# EasyEDA Pro project Glowbe-60panels.eprj

# Board PCB1
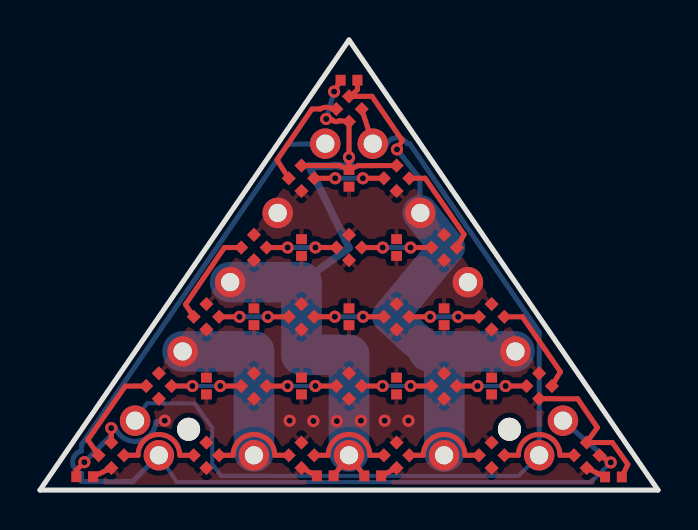
[diagram p0: board, top side]
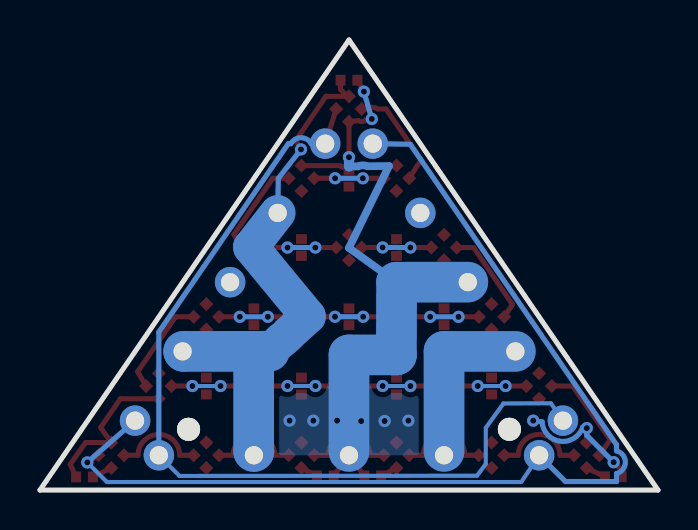
[diagram p1: board, bottom side, seen from below]

Outline 30.9 x 22.54 mm; copper layers: Top Layer, Bottom Layer. Coordinates in mm from the lower left corner of the outline.
Outline path: 0,0 30.9,0 15.45,22.54 0,0
Stack: Top Layer 0.035mm / Dielectric1 1.51mm FR4 er 4.5 / Bottom Layer 0.035mm

## Design rules (mm)
template: Custom Config
spacing copperThickness1oz (default): track to track 0.102, other pairs 0.152 to 0.3
spacing copperThickness2oz: track to track 0.203, other pairs 0.152 to 0.3
track width copperThickness1oz (default): min 0.127, default 0.254, max 2.54
track width copperThickness2oz: min 0.203, default 0.254, max 2.54
differential pair differentialPair (default): width min 0.127, default 0.254, max 2.54; gap min 0.152, default 0.152
via viaSize (default): diameter min 0.5, default 0.61, max 10; hole min 0.3, default 0.305, max 6.3

## Placement (name value [footprint] x y rotation side)
C1  100nF  [C0402]  8.32 5.21 270 top
C2  100nF  [C0402]  13.07 5.21 270 top
C3  100nF  [C0402]  17.83 5.21 270 top
C4  100nF  [C0402]  22.58 5.21 270 top
C8  100nF  [C0402]  10.7 8.68 270 top
C9  100nF  [C0402]  15.45 8.68 270 top
C10  100nF  [C0402]  20.2 8.68 270 top
C11  100nF  [C0402]  17.83 12.14 270 top
C12  100nF  [C0402]  13.07 12.14 270 top
C13  100nF  [C0402]  15.45 15.61 270 top
C17  100nF  [C0402]  28.67 0.66 0 top
C18  100nF  [C0402]  2.24 0.67 0 top
C19  100nF  [C0402]  16.64 0.71 0 top
C20  100nF  [C0402]  14.26 0.71 0 top
C21  100nF  [C0402]  15.45 20.52 0 top
LED1  SK6805-EC14  [LED-SMD_4P-L1.4-W1.4-TL]  15.45 19.08 135 top
LED2  SK6805-EC14  [LED-SMD_4P-L1.4-W1.4-TL]  17.83 15.61 315 top
LED3  SK6805-EC14  [LED-SMD_4P-L1.4-W1.4-TL]  20.2 12.14 135 top
LED4  SK6805-EC14  [LED-SMD_4P-L1.4-W1.4-TL]  22.58 8.68 315 top
LED5  SK6805-EC14  [LED-SMD_4P-L1.4-W1.4-TL]  24.96 5.21 135 top
LED6  SK6805-EC14  [LED-SMD_4P-L1.4-W1.4-TL]  27.34 1.74 315 top
LED7  SK6805-EC14  [LED-SMD_4P-L1.4-W1.4-TL]  22.58 1.74 315 top
LED8  SK6805-EC14  [LED-SMD_4P-L1.4-W1.4-TL]  17.83 1.74 315 top
LED9  SK6805-EC14  [LED-SMD_4P-L1.4-W1.4-TL]  13.07 1.74 315 top
LED10  SK6805-EC14  [LED-SMD_4P-L1.4-W1.4-TL]  8.32 1.74 315 top
LED11  SK6805-EC14  [LED-SMD_4P-L1.4-W1.4-TL]  3.57 1.74 315 top
LED12  SK6805-EC14  [LED-SMD_4P-L1.4-W1.4-TL]  5.94 5.21 135 top
LED13  SK6805-EC14  [LED-SMD_4P-L1.4-W1.4-TL]  8.32 8.68 315 top
LED14  SK6805-EC14  [LED-SMD_4P-L1.4-W1.4-TL]  10.7 12.14 135 top
LED15  SK6805-EC14  [LED-SMD_4P-L1.4-W1.4-TL]  13.07 15.61 315 top
LED16  SK6805-EC14  [LED-SMD_4P-L1.4-W1.4-TL]  15.45 12.14 135 top
LED17  SK6805-EC14  [LED-SMD_4P-L1.4-W1.4-TL]  17.83 8.68 315 top
LED18  SK6805-EC14  [LED-SMD_4P-L1.4-W1.4-TL]  20.2 5.21 135 top
LED19  SK6805-EC14  [LED-SMD_4P-L1.4-W1.4-TL]  15.45 5.21 135 top
LED20  SK6805-EC14  [LED-SMD_4P-L1.4-W1.4-TL]  10.7 5.21 135 top
LED21  SK6805-EC14  [LED-SMD_4P-L1.4-W1.4-TL]  13.07 8.68 315 top
NOREF  -  [Pad_e14]  23.47 3.04 0 top
NOREF#2  -  [Pad_e5398]  16.64 17.34 0 top
NOREF#3  -  [Pad_e5394]  7.13 6.94 0 top
NOREF#4  -  [Pad_e5400]  21.39 10.41 0 top
NOREF#5  -  [Pad_e5390]  15.45 1.74 0 top
NOREF#6  -  [Pad_e5403]  5.94 1.74 0 top
NOREF#7  -  [Pad_e5401]  23.77 6.94 0 top
NOREF#8  -  [Pad_e5388]  26.15 3.48 0 top
NOREF#9  -  [Pad_e5397]  14.26 17.34 0 top
NOREF#10  -  [Pad_e5393]  4.75 3.48 0 top
NOREF#11  -  [Pad_e5385]  24.96 1.74 0 top
NOREF#12  -  [Pad_e5389]  20.2 1.74 0 top
NOREF#13  -  [Pad_e5395]  9.51 10.41 0 top
NOREF#14  -  [Pad_e5391]  10.7 1.74 0 top
NOREF#15  -  [Pad_e15]  7.43 3.04 0 top
NOREF#16  -  [Pad_e5396]  11.89 13.88 0 top
NOREF#17  -  [Pad_e5399]  19.02 13.88 0 top

## Footprints (pads in the part's own frame, mm; a bottom-side part is the same pattern mirrored in y, then rotated)
C0402
  rect 0.5x0.54 smd: 1(-0.42,0) 2(0.42,0)
LED-SMD_4P-L1.4-W1.4-TL
  rect 0.5x0.5 smd: 1(-0.45,0.45) 2(-0.45,-0.45) 3(0.45,-0.45) 4(0.45,0.45)
Pad_e14
  round 1.153 hole 1.153: 0(0,0)
Pad_e15
  round 1.153 hole 1.153: 0(0,0)
Pad_e5385
  round 1.524 hole 0.914: 6(0,0)
Pad_e5388
  round 1.524 hole 0.914: 8(0,0)
Pad_e5389
  round 1.524 hole 0.914: 7(0,0)
Pad_e5390
  round 1.524 hole 0.914: 5(0,0)
Pad_e5391
  round 1.524 hole 0.914: 7(0,0)
Pad_e5393
  round 1.524 hole 0.914: 6(0,0)
Pad_e5394
  round 1.524 hole 0.914: 7(0,0)
Pad_e5395
  round 1.524 hole 0.914: 5(0,0)
Pad_e5396
  round 1.524 hole 0.914: 7(0,0)
Pad_e5397
  round 1.524 hole 0.914: 8(0,0)
Pad_e5398
  round 1.524 hole 0.914: 6(0,0)
Pad_e5399
  round 1.524 hole 0.914: 7(0,0)
Pad_e5400
  round 1.524 hole 0.914: 5(0,0)
Pad_e5401
  round 1.524 hole 0.914: 7(0,0)
Pad_e5403
  round 1.524 hole 0.914: 8(0,0)

## Nets
GND: C1.1 C2.1 C3.1 C4.1 C8.2 C9.2 C10.2 C11.1 C12.1 C13.2 C17.1 C18.2 C19.2 C20.1 C21.2 LED1.3 LED2.3 LED3.3 LED4.3 LED5.3 LED6.3 LED7.3 LED8.3 LED9.3 LED10.3 LED11.3 LED12.3 LED13.3 LED14.3 LED15.3 LED16.3 LED17.3 LED18.3 LED19.3 LED20.3 LED21.3 NOREF#3.7 NOREF#7.7 NOREF#12.7 NOREF#14.7 NOREF#16.7 NOREF#17.7
VDD: C1.2 C2.2 C3.2 C4.2 C8.1 C9.1 C10.1 C11.2 C12.2 C13.1 C17.2 C18.1 C19.1 C20.2 C21.1 LED1.1 LED2.1 LED3.1 LED4.1 LED5.1 LED6.1 LED7.1 LED8.1 LED9.1 LED10.1 LED11.1 LED12.1 LED13.1 LED14.1 LED15.1 LED16.1 LED17.1 LED18.1 LED19.1 LED20.1 LED21.1 NOREF#4.5 NOREF#5.5 NOREF#13.5
DI: LED6.4 NOREF#6.8 NOREF#8.8 NOREF#9.8
DO: LED1.2 NOREF#2.6 NOREF#10.6 NOREF#11.6

Pads without a net: LED1 4; LED2 2 4; LED3 2 4; LED4 2 4; LED5 2 4; LED6 2; LED7 2 4; LED8 2 4; LED9 2 4; LED10 2 4; LED11 2 4; LED12 2 4; LED13 2 4; LED14 2 4; LED15 2 4; LED16 2 4; LED17 2 4; LED18 2 4; LED19 2 4; LED20 2 4; LED21 2 4; NOREF 0; NOREF#15 0

## Via types
v1: diameter 0.61, hole 0.305, Top Layer to Bottom Layer, 34 vias

## Routing (per net, layer and track width the routed paths; a pad name or vN(x,y) marks a point on that pad's centre or on a via; arc(x,y) is an arc through that point)
GND: length 39.8
  Top Layer w0.254: 13.84,0.71 LED9.3 ; v1(17.85,17.06) 18.11,17.5 16.6,19.71 LED1.3 15.53,19.71 15.87,20.05 C21.2 ; 17.06,0.71 LED8.3 ; LED11.3 C18.2 ; LED6.3 C17.1
  Bottom Layer w0.254: v1(17.85,17.06) 18.98,15.6 NOREF#17.7
  Bottom Layer w1.778: NOREF#17.7 20.35,12.16 17.5,8.7 18.46,7.83 arc(18.61,7.68) 18.77,7.55 19.44,6.95
  Bottom Layer w2.032: 20.22,6.95 20.22,1.94 20.2,1.93 ; 20.22,6.95 23.71,6.95 23.71,6.94 ; 20.22,6.95 19.44,6.95 ; 10.7,1.93 10.7,6.94 NOREF#3.7
VDD: length 52.8
  Top Layer w0.254: C13.1 v1(15.45,16.67) 15.45,18.44 14.98,18.5 arc(14.79,18.45) 14.62,18.53 14.6,18.55 v1(14.31,18.58) ; C13.1 15.9,16.24 17.83,16.25 ; C13.1 15,16.24 13.07,16.25 ; v1(2.22,1.39) 1.82,0.99 C18.1 ; C17.2 29.39,1.29 28.62,2.38 LED6.1 27.87,3.13 26.88,4.57 LED5.1 ; 16.22,0.71 NOREF#5.5 14.68,0.71 ; C21.1 v1(14.7,19.95) ; v1(3.56,3.1) LED11.1
  Bottom Layer w0.254: v1(14.7,19.95) v1(14.31,18.58) ; v1(2.22,1.39) 3.56,2.74 v1(3.56,3.1) 3.77,3.13 arc(4.9,2.44) 5.79,3.41 v1(6.24,3.48)
  Bottom Layer w0.381: 15.45,16.2 15.01,16.21 arc(14.77,16.26) 14.52,16.21 13.45,16.22 15.45,12.12 13.07,10.41
  Bottom Layer w0.508: v1(15.45,16.67) 15.45,16.2
  Bottom Layer w2.032: 15.45,6.77 13.08,6.77 13.07,10.41 NOREF#13.5 ; 15.45,6.77 15.45,1.93
  vias: v1(12.48,3.48) v1(13.67,3.46) v1(14.84,3.45) v1(16.05,3.48) v1(17.23,3.48) v1(18.42,3.48)
(no net): length 83.9
  Top Layer w0.254: v1(9.01,5.21) LED20.4 ; LED7.4 23.92,1.74 arc(24.96,2.78) 26,1.74 LED6.2 ; v1(18.53,12.14) LED3.4 ; LED12.4 4.27,5.21 2.39,2.51 LED11.2 ; LED15.2 11.85,16.53 13.6,19.08 14,19.08 arc(14.31,19.17) 14.62,19.08 LED1.4 ; LED14.4 9.22,12.14 7.28,9.29 LED13.2 ; v1(12.38,12.14) LED14.2 ; v1(23.28,5.21) LED5.4 ; LED17.4 v1(19.51,8.67) ; LED8.4 19.16,1.74 arc(20.21,2.78) 21.25,1.74 LED7.2 ; LED12.2 v1(7.62,5.21) ; LED8.2 16.49,1.74 arc(15.45,2.78) 14.41,1.74 LED9.4 ; LED16.2 v1(17.13,12.14) ; LED20.2 v1(12.38,5.21) ; LED10.4 9.66,1.74 arc(10.7,2.78) 11.74,1.74 LED9.2 ; LED2.4 19.26,15.61 21.2,12.8 LED3.2 ; v1(9.97,8.67) LED13.4 ; 7.68,1.74 6.98,1.74 arc(5.94,2.78) 4.9,1.74 LED11.4 ; v1(18.53,5.21) LED18.4 ; v1(20.91,8.67) LED4.2 ; v1(11.39,8.67) LED21.2 ; v1(13.77,5.21) LED19.4 ; v1(13.77,12.15) LED16.4 ; LED21.4 v1(14.74,8.68) ; v1(16.15,15.61) LED2.2 ; LED15.4 v1(14.76,15.61) ; 23.22,8.68 24.12,8.67 26.02,5.92 LED5.2 ; LED19.2 v1(17.13,5.21) ; LED18.2 v1(21.88,5.21) ; v1(16.15,8.68) LED17.2
  Bottom Layer w0.203: v1(18.53,5.21) v1(17.13,5.21) ; v1(9.01,5.21) v1(7.62,5.21) ; v1(21.88,5.21) v1(23.28,5.21) ; v1(13.77,5.21) v1(12.38,5.21)
  Bottom Layer w0.254: v1(18.53,12.14) v1(17.13,12.14) ; v1(13.77,12.15) v1(12.38,12.14) ; v1(19.51,8.67) v1(20.91,8.67) ; v1(14.76,15.61) v1(16.15,15.61) ; v1(9.97,8.67) v1(11.39,8.67) ; v1(14.74,8.68) v1(16.15,8.68)
DI: length 54.3
  Top Layer w0.254: LED6.4 v1(28.53,1.38)
  Bottom Layer w0.203: v1(28.53,1.38) 27.55,0.4 6.83,0.4 NOREF#6.8
  Bottom Layer w0.254: NOREF#6.8 4.63,0.43 2.07,0.43 2.07,0.83 arc(1.63,1.39) 2.07,1.96 2.07,2.27 12.39,17.31 NOREF#9.8 ; v1(28.53,1.38) NOREF#8.8
DO: length 45.3
  Top Layer w0.254: LED1.2 NOREF#2.6
  Bottom Layer w0.203: NOREF#10.6 5.35,4.34 7.73,4.33 8.61,3.11 8.61,1.31 9.05,0.72 23.92,0.71 NOREF#11.6
  Bottom Layer w0.254: NOREF#2.6 17.34,17.34 arc(17.85,17.64) 18.36,17.34 18.49,17.34 24.96,7.91 NOREF#11.6

## Copper pours and planes (outline as drawn; the poured copper is in the pictures)
GND on Top Layer: 3.57,1.74 2.38,0.01 28.54,0.01 27.34,1.74
GND on Top Layer: 7.43,8.24 5.65,5.64 25.26,5.64 23.47,8.24
GND on Top Layer: 10.4,12.58 12.18,15.18 18.72,15.18 20.5,12.58
VDD on Top Layer: 3.86,2.17 5.65,4.78 25.26,4.78 27.04,2.17
VDD on Top Layer: 8.02,9.11 9.81,11.71 21.1,11.71 22.88,9.11
VDD on Bottom Layer: 10.7,1.74 10.7,5.21 20.2,5.21 20.2,1.74

# Board PCB2
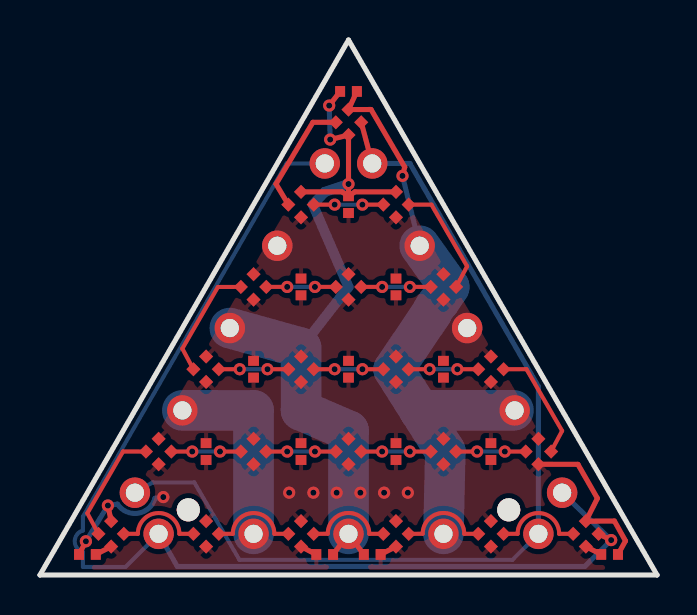
[diagram p2: board, top side]
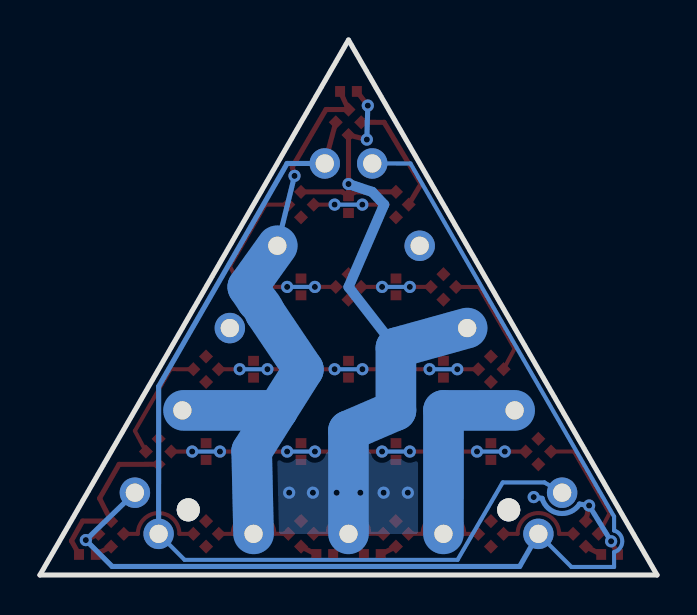
[diagram p3: board, bottom side, seen from below]

Outline 30.9 x 26.76 mm; copper layers: Top Layer, Bottom Layer. Coordinates in mm from the lower left corner of the outline.
Outline path: 0,0 30.9,0 15.45,26.76 0,0
Stack: Top Layer 0.035mm / Dielectric1 1.51mm FR4 er 4.5 / Bottom Layer 0.035mm

## Design rules (mm)
template: Custom Config
spacing copperThickness1oz (default): track to track 0.102, other pairs 0.152 to 0.3
spacing copperThickness2oz: track to track 0.203, other pairs 0.152 to 0.3
track width copperThickness1oz (default): min 0.127, default 0.254, max 2.54
track width copperThickness2oz: min 0.203, default 0.254, max 2.54
differential pair differentialPair (default): width min 0.127, default 0.254, max 2.54; gap min 0.152, default 0.152
via viaSize (default): diameter min 0.5, default 0.61, max 10; hole min 0.3, default 0.305, max 6.3
net VDD uses direct
net GND uses direct

## Placement (name value [footprint] x y rotation side)
C1  100nF  [C0402]  15.45 18.53 270 top
C2  100nF  [C0402]  13.07 14.41 270 top
C3  100nF  [C0402]  17.83 14.41 270 top
C4  100nF  [C0402]  10.7 10.29 270 top
C5  100nF  [C0402]  15.45 10.29 270 top
C6  100nF  [C0402]  20.2 10.29 270 top
C7  100nF  [C0402]  8.32 6.18 270 top
C8  100nF  [C0402]  13.07 6.18 270 top
C9  100nF  [C0402]  17.83 6.18 270 top
C10  100nF  [C0402]  22.58 6.18 270 top
C11  100nF  [C0402]  14.26 1.03 0 top
C12  100nF  [C0402]  16.64 1.03 0 top
C13  100nF  [C0402]  2.38 1.03 0 top
C14  100nF  [C0402]  28.52 1.03 0 top
C15  100nF  [C0402]  15.45 24.19 0 top
LED1  SK6805-EC14  [LED-SMD_4P-L1.4-W1.4-TL]  15.45 22.64 135 top
LED2  SK6805-EC14  [LED-SMD_4P-L1.4-W1.4-TL]  17.83 18.53 315 top
LED3  SK6805-EC14  [LED-SMD_4P-L1.4-W1.4-TL]  20.2 14.41 135 top
LED4  SK6805-EC14  [LED-SMD_4P-L1.4-W1.4-TL]  22.58 10.29 315 top
LED5  SK6805-EC14  [LED-SMD_4P-L1.4-W1.4-TL]  24.96 6.18 135 top
LED6  SK6805-EC14  [LED-SMD_4P-L1.4-W1.4-TL]  27.33 2.06 315 top
LED7  SK6805-EC14  [LED-SMD_4P-L1.4-W1.4-TL]  22.58 2.06 315 top
LED8  SK6805-EC14  [LED-SMD_4P-L1.4-W1.4-TL]  17.83 2.06 315 top
LED9  SK6805-EC14  [LED-SMD_4P-L1.4-W1.4-TL]  13.07 2.06 315 top
LED10  SK6805-EC14  [LED-SMD_4P-L1.4-W1.4-TL]  8.32 2.06 315 top
LED11  SK6805-EC14  [LED-SMD_4P-L1.4-W1.4-TL]  3.56 2.06 315 top
LED12  SK6805-EC14  [LED-SMD_4P-L1.4-W1.4-TL]  5.94 6.18 135 top
LED13  SK6805-EC14  [LED-SMD_4P-L1.4-W1.4-TL]  8.32 10.29 315 top
LED14  SK6805-EC14  [LED-SMD_4P-L1.4-W1.4-TL]  10.7 14.41 135 top
LED15  SK6805-EC14  [LED-SMD_4P-L1.4-W1.4-TL]  13.07 18.53 315 top
LED16  SK6805-EC14  [LED-SMD_4P-L1.4-W1.4-TL]  15.45 14.41 135 top
LED17  SK6805-EC14  [LED-SMD_4P-L1.4-W1.4-TL]  17.83 10.29 315 top
LED18  SK6805-EC14  [LED-SMD_4P-L1.4-W1.4-TL]  20.2 6.18 135 top
LED19  SK6805-EC14  [LED-SMD_4P-L1.4-W1.4-TL]  15.45 6.18 135 top
LED20  SK6805-EC14  [LED-SMD_4P-L1.4-W1.4-TL]  10.7 6.18 135 top
LED21  SK6805-EC14  [LED-SMD_4P-L1.4-W1.4-TL]  13.07 10.29 315 top
NOREF  -  [Pad_e7]  19.01 16.47 0 top
NOREF#2  -  [Pad_e1]  15.45 2.06 0 top
NOREF#3  -  [Pad_e8]  16.64 20.58 0 top
NOREF#4  -  [Pad_e6]  21.39 12.35 0 top
NOREF#5  -  [Pad_e1615]  4.75 4.12 0 top
NOREF#6  -  [Pad_e3]  24.96 2.06 0 top
NOREF#7  -  [Pad_e2833]  7.43 3.26 0 top
NOREF#8  -  [Pad_e9]  14.26 20.58 0 top
NOREF#9  -  [Pad_e12]  7.13 8.23 0 top
NOREF#10  -  [Pad_e2]  20.2 2.06 0 top
NOREF#11  -  [Pad_e5]  23.77 8.23 0 top
NOREF#12  -  [Pad_e1561]  5.94 2.06 0 top
NOREF#13  -  [Pad_e4]  26.15 4.12 0 top
NOREF#14  -  [Pad_e10]  11.88 16.47 0 top
NOREF#15  -  [Pad_e11]  9.51 12.35 0 top
NOREF#16  -  [Pad_e2834]  23.47 3.26 0 top
NOREF#17  -  [Pad_e0]  10.7 2.06 0 top

## Footprints (pads in the part's own frame, mm; a bottom-side part is the same pattern mirrored in y, then rotated)
C0402
  rect 0.5x0.54 smd: 1(-0.42,0) 2(0.42,0)
LED-SMD_4P-L1.4-W1.4-TL
  rect 0.5x0.5 smd: 1(-0.45,0.45) 2(-0.45,-0.45) 3(0.45,-0.45) 4(0.45,0.45)
Pad_e0
  round 1.524 hole 0.914: 7(0,0)
Pad_e1
  round 1.524 hole 0.914: 5(0,0)
Pad_e2
  round 1.524 hole 0.914: 7(0,0)
Pad_e3
  round 1.524 hole 0.914: 6(0,0)
Pad_e4
  round 1.524 hole 0.914: 8(0,0)
Pad_e5
  round 1.524 hole 0.914: 7(0,0)
Pad_e6
  round 1.524 hole 0.914: 5(0,0)
Pad_e7
  round 1.524 hole 0.914: 7(0,0)
Pad_e8
  round 1.524 hole 0.914: 6(0,0)
Pad_e9
  round 1.524 hole 0.914: 8(0,0)
Pad_e10
  round 1.524 hole 0.914: 7(0,0)
Pad_e11
  round 1.524 hole 0.914: 5(0,0)
Pad_e12
  round 1.524 hole 0.914: 7(0,0)
Pad_e1561
  round 1.524 hole 0.914: 8(0,0)
Pad_e1615
  round 1.524 hole 0.914: 6(0,0)
Pad_e2833
  round 1.153 hole 1.153: 0(0,0)
Pad_e2834
  round 1.153 hole 1.153: 0(0,0)

## Nets
GND: C1.2 C2.1 C3.1 C4.2 C5.2 C6.2 C7.1 C8.1 C9.1 C10.1 C11.1 C12.2 C13.2 C14.1 C15.2 LED1.3 LED2.3 LED3.3 LED4.3 LED5.3 LED6.3 LED7.3 LED8.3 LED9.3 LED10.3 LED11.3 LED12.3 LED13.3 LED14.3 LED15.3 LED16.3 LED17.3 LED18.3 LED19.3 LED20.3 LED21.3 NOREF.7 NOREF#9.7 NOREF#10.7 NOREF#11.7 NOREF#14.7 NOREF#17.7
VDD: C1.1 C2.2 C3.2 C4.1 C5.1 C6.1 C7.2 C8.2 C9.2 C10.2 C11.2 C12.1 C13.1 C14.2 C15.1 LED1.1 LED2.1 LED3.1 LED4.1 LED5.1 LED6.1 LED7.1 LED8.1 LED9.1 LED10.1 LED11.1 LED12.1 LED13.1 LED14.1 LED15.1 LED16.1 LED17.1 LED18.1 LED19.1 LED20.1 LED21.1 NOREF#2.5 NOREF#4.5 NOREF#15.5
DI: LED6.4 NOREF#8.8 NOREF#12.8 NOREF#13.8
DO: LED1.2 NOREF#3.6 NOREF#5.6 NOREF#6.6

Pads without a net: LED1 4; LED2 2 4; LED3 2 4; LED4 2 4; LED5 2 4; LED6 2; LED7 2 4; LED8 2 4; LED9 2 4; LED10 2 4; LED11 2 4; LED12 2 4; LED13 2 4; LED14 2 4; LED15 2 4; LED16 2 4; LED17 2 4; LED18 2 4; LED19 2 4; LED20 2 4; LED21 2 4; NOREF#7 0; NOREF#16 0

## Via types
v1: diameter 0.61, hole 0.305, Top Layer to Bottom Layer, 34 vias

## Routing (per net, layer and track width the routed paths; a pad name or vN(x,y) marks a point on that pad's centre or on a via; arc(x,y) is an arc through that point)
GND: length 43.9
  Top Layer w0.254: LED9.3 C11.1 ; 28.1,1.03 LED6.3 ; C12.2 LED8.3 ; v1(18.15,19.96) 18.26,20.4 16.58,23.28 LED1.3 C15.2 ; 2.8,1.03 LED11.3
  Bottom Layer w0.254: v1(18.15,19.96) NOREF.7
  Bottom Layer w2.032: NOREF#10.7 20.3,6.19 19.01,8.23 ; NOREF.7 20.49,14.41 20.02,13.71 arc(19.79,13.43) 19.62,13.12 17.71,10.28 19.01,8.23 ; 19.01,8.23 23.71,8.23 ; NOREF#17.7 10.69,8.23 NOREF#9.7
VDD: length 54.6
  Top Layer w0.254: v1(14.53,21.78) LED1.1 v1(15.45,19.56) C1.1 ; v1(3.4,3.48) 3.56,2.7 ; C1.1 15.77,19.16 LED2.1 ; C1.1 15.13,19.16 LED15.1 ; C14.2 29.32,1.71 28.76,2.7 27.33,2.7 27.91,3.84 26.94,5.53 LED5.1 ; C15.1 v1(14.48,23.48) ; C11.2 NOREF#2.5 C12.1 ; C13.1 v1(2.3,1.69)
  Bottom Layer w0.254: v1(2.3,1.69) v1(3.4,3.48) 3.88,3.55 arc(4.91,3.09) 5.76,3.83 v1(6.18,3.9) ; v1(14.48,23.48) v1(14.53,21.78)
  Bottom Layer w0.508: v1(15.45,19.56) 14.26,19.16 13.66,18.53 15.45,14.41 13.07,11.36
  Bottom Layer w2.032: NOREF#2.5 15.45,7.21 13.07,8.24 13.07,11.36 NOREF#15.5
  vias: v1(12.48,4.12) v1(13.69,4.12) v1(14.86,4.12) v1(16.04,4.12) v1(17.23,4.12) v1(18.42,4.12)
(no net): length 87.6
  Top Layer w0.203: LED18.2 v1(21.89,6.18) ; 23.22,2.06 23.92,2.06 arc(24.96,3.1) 26,2.06 LED6.2 ; LED17.2 v1(16.15,10.29) ; LED21.2 v1(11.39,10.29) ; LED12.2 v1(7.62,6.18) ; LED14.2 v1(12.38,14.41) ; v1(14.75,10.29) LED21.4 ; LED9.4 14.41,2.06 arc(15.45,3.1) 16.49,2.06 LED8.2 ; 23.22,10.29 24.36,10.29 26.15,7.21 LED5.2 ; v1(13.77,14.41) LED16.4 ; LED11.2 2.37,3.09 4.16,6.18 LED12.4 ; LED2.4 19.6,18.52 21.39,15.44 LED3.2 ; LED20.2 v1(12.38,6.18) ; LED4.2 v1(20.9,10.29) ; LED19.2 v1(17.13,6.18) ; v1(9.01,6.18) LED20.4 ; LED11.4 4.9,2.06 arc(5.94,3.1) 6.98,2.06 7.68,2.06 ; LED2.2 v1(16.15,18.53) ; LED7.2 21.24,2.06 arc(20.21,3.1) 19.16,2.06 LED8.4 ; v1(18.52,14.41) 19.57,14.41 ; LED10.4 9.65,2.06 arc(10.7,3.1) 11.74,2.06 LED9.2 ; LED14.4 8.91,14.41 7.13,11.32 7.68,10.29 ; v1(10,10.29) LED13.4 ; v1(14.76,18.53) LED15.4 ; LED16.2 v1(17.13,14.41) ; v1(13.77,6.18) LED19.4 ; v1(23.28,6.18) LED5.4 ; v1(18.52,6.18) 19.57,6.18 ; v1(19.51,10.29) LED17.4
  Top Layer w0.254: LED1.4 13.67,22.64 11.82,19.56 LED15.2
  Bottom Layer w0.203: v1(16.15,10.29) v1(14.75,10.29) ; v1(21.89,6.18) v1(23.28,6.18) ; v1(10,10.29) v1(11.39,10.29) ; v1(7.62,6.18) v1(9.01,6.18) ; v1(14.76,18.53) v1(16.15,18.53) ; v1(12.38,14.41) v1(13.77,14.41) ; v1(17.13,6.18) v1(18.52,6.18) ; v1(17.13,14.41) v1(18.52,14.41) ; v1(20.9,10.29) v1(19.51,10.29) ; v1(12.38,6.18) v1(13.77,6.18)
DI: length 57.9
  Top Layer w0.254: LED6.4 v1(28.6,1.75)
  Bottom Layer w0.203: NOREF#8.8 12.35,20.58 2.15,2.92 2.15,2.23 arc(1.74,1.69) 2.15,1.15 2.15,0.4 4.28,0.4 NOREF#12.8
  Bottom Layer w0.254: NOREF#13.8 v1(28.6,1.75) 27.28,0.43 6.88,0.43 NOREF#12.8
DO: length 47.4
  Top Layer w0.254: LED1.2 NOREF#3.6
  Bottom Layer w0.203: NOREF#6.6 23.66,0.76 9.99,0.76 7.73,4.63 5.64,4.63 NOREF#5.6
  Bottom Layer w0.254: NOREF#6.6 24.96,9.43 18.53,20.57 18.52,20.58 NOREF#3.6

## Copper pours and planes (outline as drawn; the poured copper is in the pictures)
GND on Top Layer: 10.1,14.41 12.48,18.53 18.46,18.53 20.8,14.41
GND on Top Layer: 7.72,10.29 5.35,6.18 25.55,6.18 23.17,10.29
GND on Top Layer: 3.56,2.06 2.38,0 28.52,0 27.33,2.06
VDD on Top Layer: 7.72,10.29 10.1,14.41 20.8,14.41 23.17,10.29
VDD on Top Layer: 3.56,2.06 5.94,6.18 24.96,6.18 27.33,2.06
VDD on Bottom Layer: 10.67,2.06 20.2,2.06 20.2,6.18 10.71,6.14
